# Altium project signal_circuit.PrjPcb
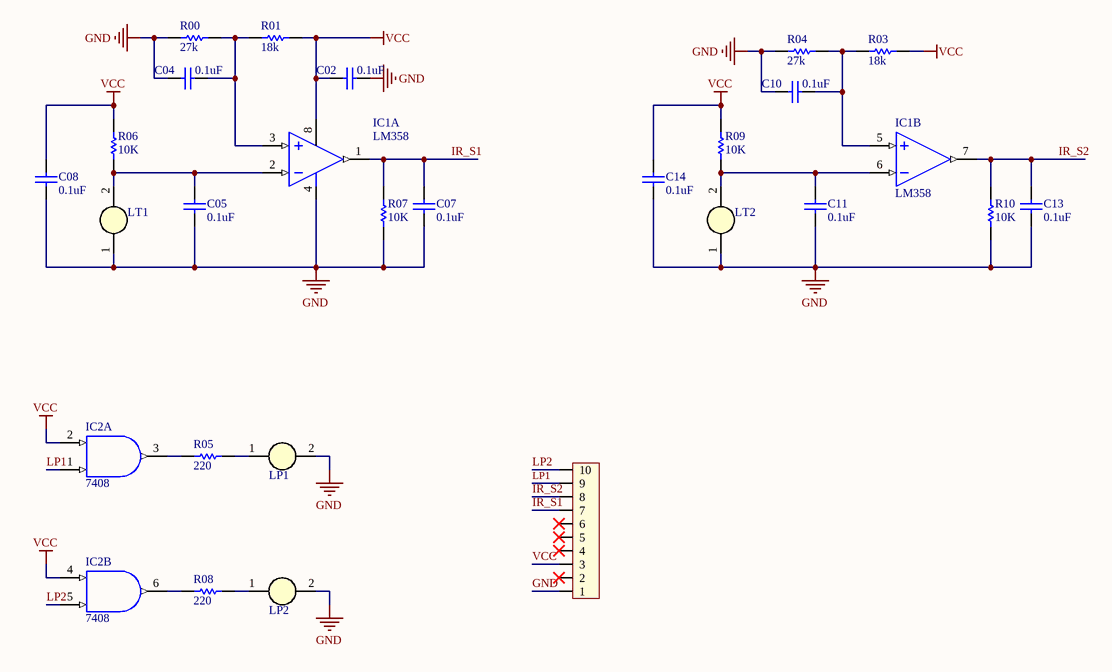
[diagram p0: signal_circuit_Sch.SchDoc]
1 sheet, 26 parts. Net scope: global (net labels, ports and power ports of the same name join across sheets).
Board files: signal_circuit_PCB.PcbDoc, PCB1.PcbDoc

## Sheet signal_circuit_Sch.SchDoc
size 297 x 209 mm; SheetNumber: 1; SheetTotal: 1

### Parts
C02  value 0.1uF  [CAP-SM-0603]  (hidden comment: Cap Non-Pol SMD)
C04  value 0.1uF  [CAP-SM-0603]  (hidden comment: Cap Non-Pol SMD)
C05  value 0.1uF  [CAP-SM-0603]  (hidden comment: Cap Non-Pol SMD)
C07  value 0.1uF  [CAP-SM-0603]  (hidden comment: Cap Non-Pol SMD)
C08  value 0.1uF  [CAP-SM-0603]  (hidden comment: Cap Non-Pol SMD)
C10  value 0.1uF  [CAP-SM-0603]  (hidden comment: Cap Non-Pol SMD)
C11  value 0.1uF  [CAP-SM-0603]  (hidden comment: Cap Non-Pol SMD)
C13  value 0.1uF  [CAP-SM-0603]  (hidden comment: Cap Non-Pol SMD)
C14  value 0.1uF  [CAP-SM-0603]  (hidden comment: Cap Non-Pol SMD)
H0  RIGHT  [XH2.54M-10]  (value not drawn)
IC1  LM358  [SO8]  (parts A,B of 2)
IC2  7408  [SO14]  (parts A,B of 4)
LP1  LED 5mm  [LED-5MM-WHITE]  (value not drawn)
LP2  LED 5mm  [LED-5MM-WHITE]  (value not drawn)
LT1  LED 5mm  [LED-5MM-WHITE]  (value not drawn)
LT2  LED 5mm  [LED-5MM-WHITE]  (value not drawn)
R00  value 27k  [RES-SM-0603]  (hidden comment: RESISTOR SMD)
R01  value 18k  [RES-SM-0603]  (hidden comment: RESISTOR SMD)
R03  value 18k  [RES-SM-0603]  (hidden comment: RESISTOR SMD)
R04  value 27k  [RES-SM-0603]  (hidden comment: RESISTOR SMD)
R05  value 220  [RES-SM-0603]  (hidden comment: RESISTOR SMD)
R06  value 10K  [RES-SM-0603]  (hidden comment: RESISTOR SMD)
R07  value 10K  [RES-SM-0603]  (hidden comment: RESISTOR SMD)
R08  value 220  [RES-SM-0603]  (hidden comment: RESISTOR SMD)
R09  value 10K  [RES-SM-0603]  (hidden comment: RESISTOR SMD)
R10  value 10K  [RES-SM-0603]  (hidden comment: RESISTOR SMD)

### Nets
GND: C02.2 C04.1 C05.2 C07.2 C08.2 C10.2 C11.2 C13.2 C14.2 H0.1 IC1.4(-V) IC2.7(GND) LP1.2(K) LP2.2(K) LT1.1(A) LT2.1(A) R00.1 R04.1 R07.1 R10.1
VCC: C02.1 C08.1 C14.1 H0.3 IC1.8(+V) IC2.2(B) IC2.4(A) IC2.14(VCC) R01.2 R03.2 R06.2 R09.2
IR_S1: C07.1 H0.7 IC1.1(OUT) R07.2
IR_S2: C13.1 H0.8 IC1.7(OUT) R10.2
LP1: H0.9 IC2.1(A)
LP2: H0.10 IC2.5(B)
NetC04_2: C04.2 IC1.3(IN+) R00.2 R01.1
NetC05_1: C05.1 IC1.2(IN-) LT1.2(K) R06.1
NetC10_1: C10.1 IC1.5(IN+) R03.1 R04.2
NetC11_1: C11.1 IC1.6(IN-) LT2.2(K) R09.1
NetIC2_3: IC2.3(O) R05.2
NetIC2_6: IC2.6(O) R08.2
NetLP1_1: LP1.1(A) R05.1
NetLP2_1: LP2.1(A) R08.1

Not connected (* = marked no-connect by the designer): H0 2* 4* 5* 6*

### Notes on the sheet
- NGUYEN VAN SON

### Library data of the parts
C02 C04 C05 C07 C08 C10 C11 C13 C14 = Cap Non-Pol SMD: Capacitor
H0 = Header 10P 2.54 Duc Thang: Cắm; Ten_Linh_Kien: Header 10P XH2.54-10P Đực Thẳng; Don_Vi: Con; Ma_Hang: MH001286; Chung_Loai: Cắm
IC1 = LM358: Low-Power Dual Operational Amplifier; Value: LM358
IC2 = 7408: Quad 2-Input AND Gate; Value: 7408
LP1 LP2 LT1 LT2 = LED 5mm Trang: Cắm; Don_Vi: Con; Ma_Hang: MH008983; Ten_Linh_Kien: Led 5MM Trắng Đục (1000c); Ghi_Chu: *; Kieu_Chan: *; Chung_Loai: Cắm
R00 R01 R03 R04 R05 R06 R07 R08 R09 R10 = RESISTOR SMD: Resistor